# Altium schematic sheet 大直-絕境擴散-生化威脅掃描系統.SchDoc
size A3
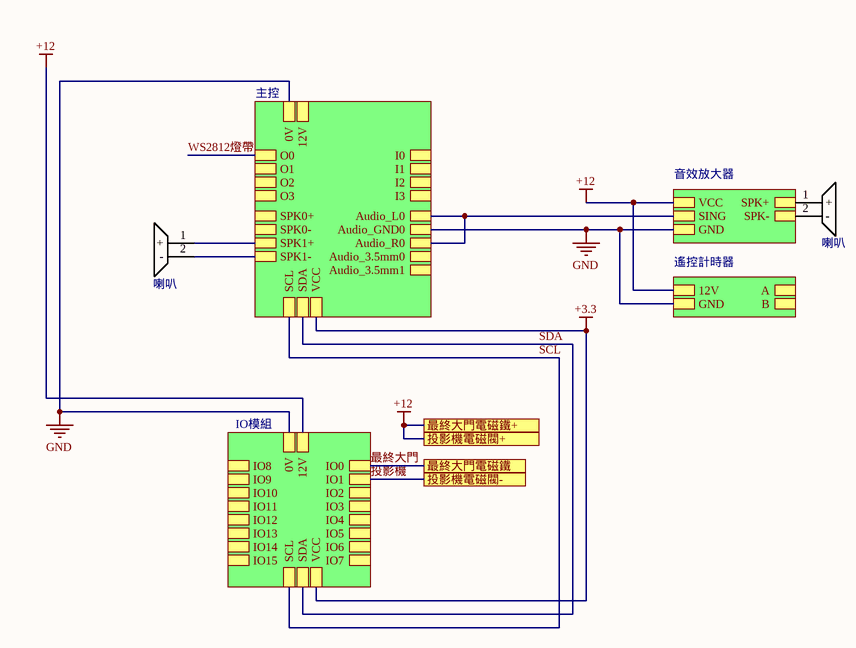
[diagram p0: 大直-絕境擴散-生化威脅掃描系統.SchDoc]

## Parts
B46  喇叭  [Buzzer_12085]
B47  喇叭  [Buzzer_12085]

## Sub-sheets
IO模組 = IO模組_MCP23017_20240819.SchDoc: VCC, 12V, 0V, SCL, SDA, IO15, IO14, IO10, IO0, IO3, IO4, IO5, IO8, IO11, IO6, IO7, IO12, IO13, IO2, IO1, IO9
主控 = ESP32主控_20240812.SchDoc: 12V, SDA, VCC, 0V, SCL, O3, O2, O1, O0, I3, I2, I1, I0, SPK0+, Audio_3.5mm1, Audio_L0, SPK0-, Audio_R0, SPK1+, SPK1-, Audio_3.5mm0, Audio_GND0
遙控計時器 = File Name: 12V, GND, B, A
音效放大器 = File Name: VCC, SING, GND, SPK-, SPK+

## Ports
投影機電磁閥+, 投影機電磁閥-, 最終大門電磁鐵, 最終大門電磁鐵+

## Nets
+3.3: sheet 主控/VCC, sheet IO模組/VCC
+12: port 投影機電磁閥+, port 最終大門電磁鐵+, sheet 音效放大器/VCC, sheet 遙控計時器/12V, sheet IO模組/12V
GND: sheet 主控/0V, sheet 主控/Audio_GND0, sheet 音效放大器/GND, sheet 遙控計時器/GND, sheet IO模組/0V
SCL: sheet 主控/SCL, sheet IO模組/SCL
SDA: sheet 主控/SDA, sheet IO模組/SDA
WS2812燈帶: sheet 主控/O0
投影機: port 投影機電磁閥-, sheet IO模組/IO1
最終大門: port 最終大門電磁鐵, sheet IO模組/IO0
NetB46_1: B46.1(+) ; sheet 音效放大器/SPK+
NetB46_2: B46.2(-) ; sheet 音效放大器/SPK-
NetB47_1: B47.1(+) ; sheet 主控/SPK1+
NetB47_2: B47.2(-) ; sheet 主控/SPK1-
(unnamed): sheet 主控/Audio_L0, sheet 主控/Audio_R0, sheet 音效放大器/SING

## Library data of the parts
B46 B47 = Buzzer: 無源蜂鳴器